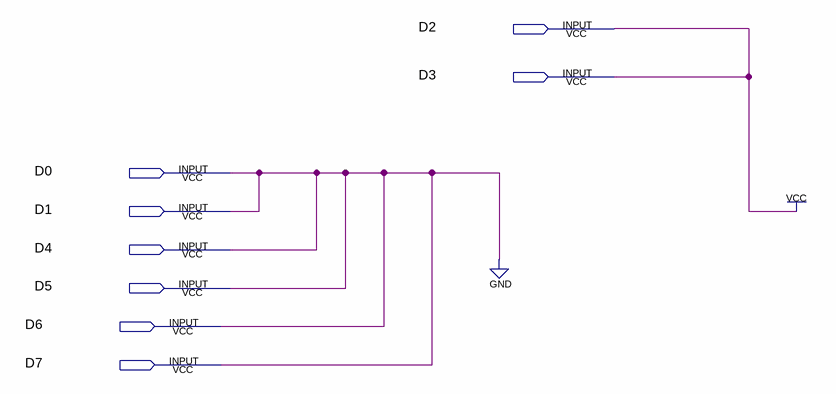
[diagram p0: schematic sheet]
// Quartus schematic MUX8TO1.bdf as structural Verilog: 0 symbols, 8 pins
module MUX8TO1 (
  input  D2,
  input  D3,
  input  D0,
  input  D1,
  input  D4,
  input  D5,
  input  D6,
  input  D7
);


  assign D1 = D0;
  assign D3 = D2;
  assign D4 = D0;
  assign D5 = D0;
  assign D6 = D0;
  assign D7 = D0;
  // also tied to GND on the sheet: D0
  // also tied to VCC on the sheet: D2
endmodule
